# EAGLE design LB_BIT_i35_delay-v03(5_5) (EAGLE 6.6.0)
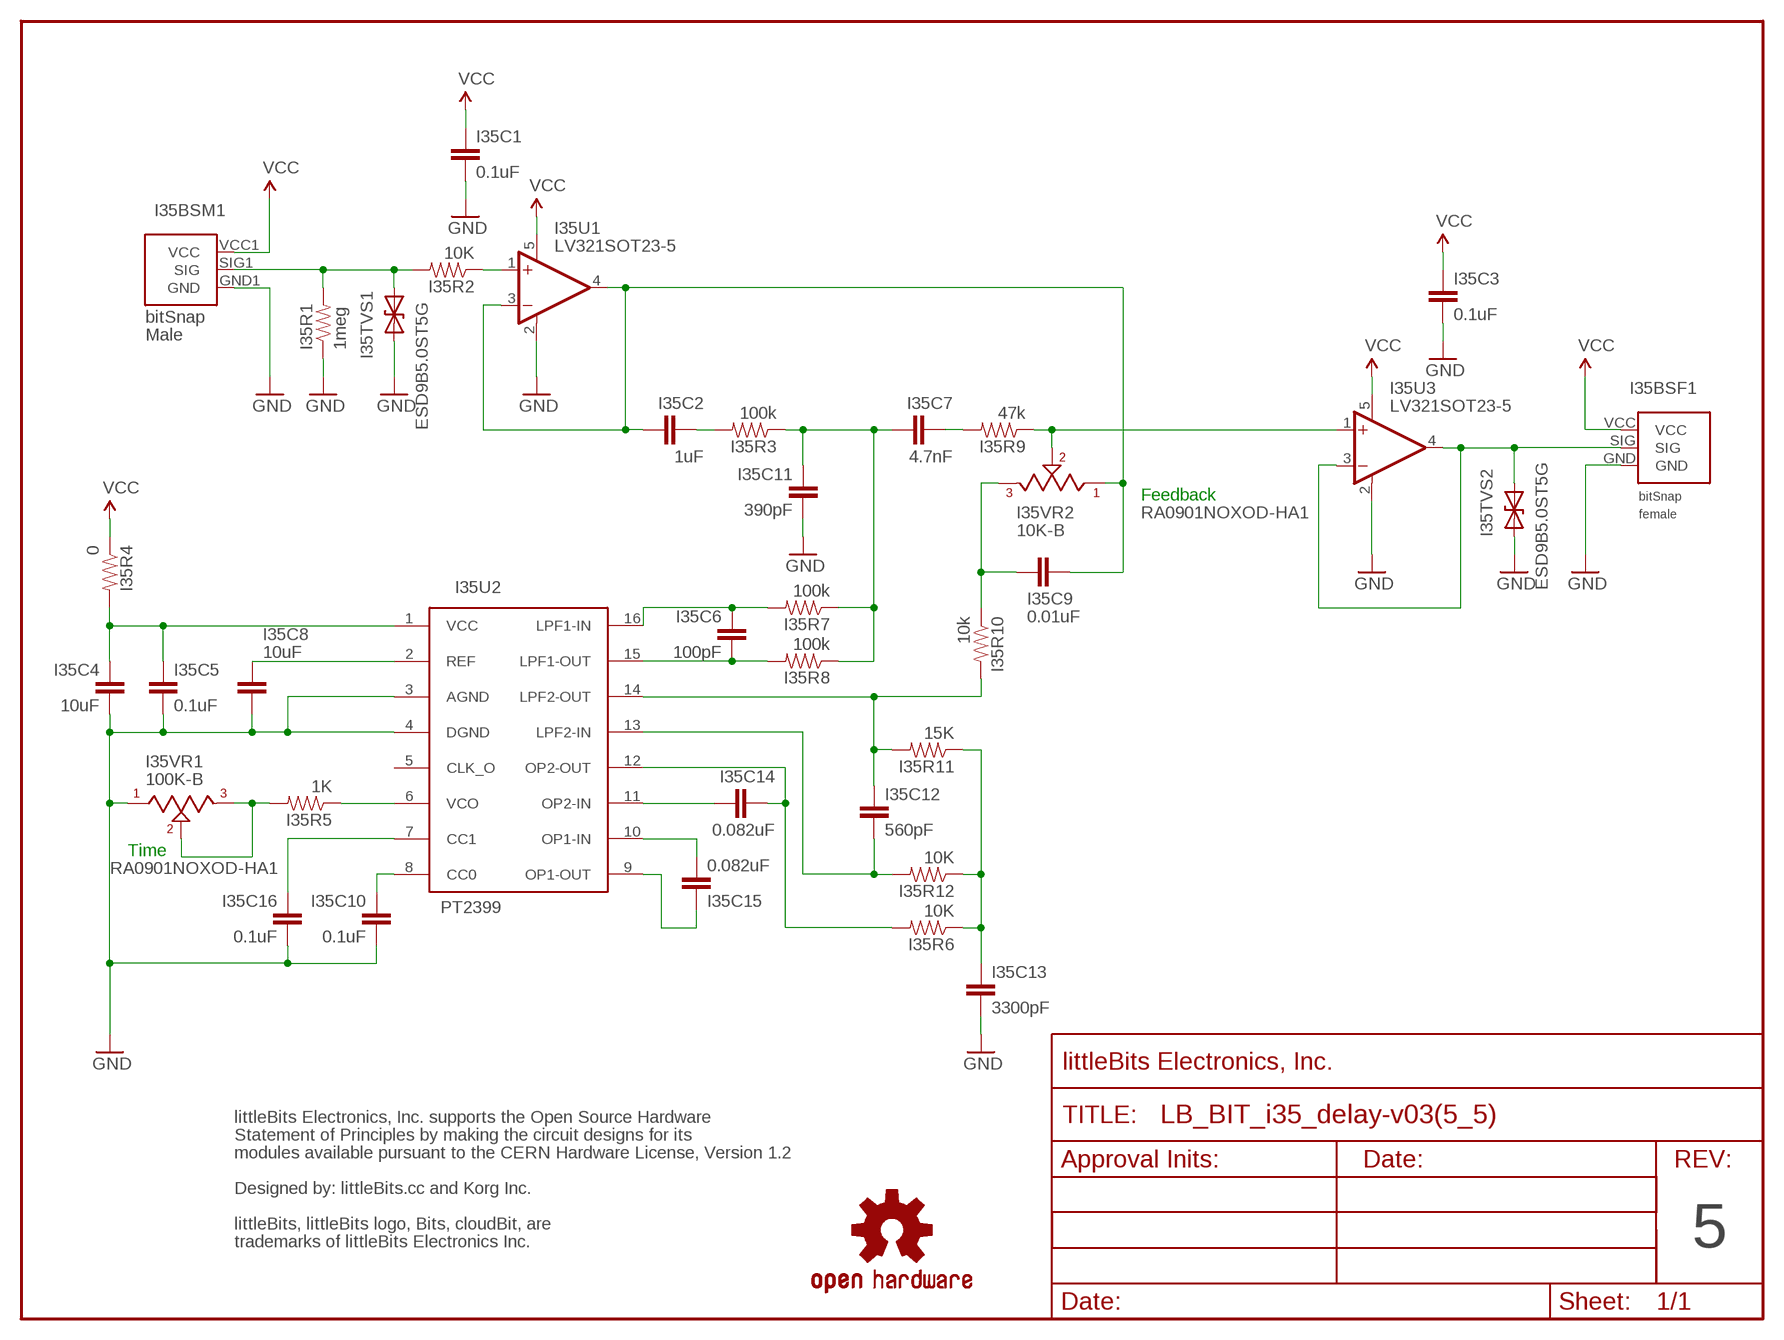
[diagram p0: schematic, sheet 1]

## Parts
I35BSF1  BITSNAP_V03_FEMALE  [BITSNAP_V03_FEMALE]
I35BSM1  BITSNAP_V03_MALE  [BITSNAP_V03_MALE]
I35C1  0.1uF  CAPCAP-0603  [CAP-0603]
I35C2  1uF  CAPCAP-0603  [CAP-0603]
I35C3  0.1uF  CAPCAP-0603  [CAP-0603]
I35C4  10uF  CAPCAP-0603  [CAP-0603]
I35C5  0.1uF  CAPCAP-0603  [CAP-0603]
I35C6  100pF  CAPCAP-0603  [CAP-0603]
I35C7  4.7nF  CAPCAP-0603  [CAP-0603]
I35C8  10uF  CAPCAP-0603  [CAP-0603]
I35C9  0.01uF  CAPCAP-0603  [CAP-0603]
I35C10  0.1uF  CAPCAP-0603  [CAP-0603]
I35C11  390pF  CAPCAP-0603  [CAP-0603]
I35C12  560pF  CAPCAP-0603  [CAP-0603]
I35C13  3300pF  CAPCAP-0603  [CAP-0603]
I35C14  0.082uF  CAPCAP-0603  [CAP-0603]
I35C15  0.082uF  CAPCAP-0603  [CAP-0603]
I35C16  0.1uF  CAPCAP-0603  [CAP-0603]
I35R1  1meg  RESISTOR0603  [RES-0603]
I35R2  10K  RESISTOR0603  [RES-0603]
I35R3  100k  RESISTOR0603  [RES-0603]
I35R4  0  RESISTOR0603  [RES-0603]
I35R5  1K  RESISTOR0603  [RES-0603]
I35R6  10K  RESISTOR0603  [RES-0603]
I35R7  100k  RESISTOR0603  [RES-0603]
I35R8  100k  RESISTOR0603  [RES-0603]
I35R9  47k  RESISTOR0603  [RES-0603]
I35R10  10k  RESISTOR0603  [RES-0603]
I35R11  15K  RESISTOR0603  [RES-0603]
I35R12  10K  RESISTOR0603  [RES-0603]
I35TVS1  ESD9B5.0ST5G  DIODE-TVSSOD-923  [SOD-923]
I35TVS2  ESD9B5.0ST5G  DIODE-TVSSOD-923  [SOD-923]
I35U1  LV321SOT23-5  [SOT23-5]
I35U2  PT2399  [SO16]
I35U3  LV321SOT23-5  [SOT23-5]
I35VR1  100K-B  ALPS_POTTH  [ALPS_POT]
I35VR2  10K-B  ALPS_POTTH  [ALPS_POT]
U$1  FRAME-LETTER-OHWOHW  [FABDWG01-OHW]
U$2  OSHWCREDIT-KORG  [OSHWCREDIT-KORG]
U$3  OSHW-LOGOL  [OSHW-LOGO-L]

## Nets
GND: I35BSF1.GND I35BSM1.GND1(GND) I35C1.2 I35C3.2 I35C4.2 I35C5.2 I35C8.2 I35C10.2 I35C11.2 I35C13.2 I35C16.2 I35R1.1 I35TVS1.1(A) I35TVS2.1(A) I35U1.2(V-) I35U2.3(AGND) I35U2.4(DGND) I35U3.2(V-) I35VR1.1
N$1: I35C2.2 I35R3.2
N$4: I35R2.1 I35U1.1(+IN)
N$6: I35C7.1 I35C11.1 I35R3.1 I35R7.1 I35R8.1
N$10: I35C6.2 I35R8.2 I35U2.15(LPF1-OUT)
N$11: I35C6.1 I35R7.2 I35U2.16(LPF1-IN)
N$13: I35R9.1 I35U3.1(+IN) I35VR2.2
N$14: I35C7.2 I35R9.2
N$15: I35C9.1 I35R10.1 I35VR2.3
N$16: I35C2.1 I35C9.2 I35U1.3(-IN) I35U1.4(OUT) I35VR2.1
N$17: I35C12.1 I35R10.2 I35R11.2 I35U2.14(LPF2-OUT)
N$18: I35C12.2 I35R12.2 I35U2.13(LPF2-IN)
N$19: I35C13.1 I35R6.1 I35R11.1 I35R12.1
N$20: I35C14.2 I35R6.2 I35U2.12(OP2-OUT)
N$21: I35C14.1 I35U2.11(OP2-IN)
N$22: I35C15.2 I35U2.10(OP1-IN)
N$24: I35C15.1 I35U2.9(OP1-OUT)
N$25: I35C10.1 I35U2.8(CC0)
N$26: I35C16.1 I35U2.7(CC1)
N$28: I35R5.2 I35VR1.2 I35VR1.3
N$29: I35R5.1 I35U2.6(VCO)
N$31: I35C8.1 I35U2.2(REF)
N$32: I35C4.1 I35C5.1 I35R4.2 I35U2.1(VCC)
SIG_IN: I35BSM1.SIG1(SIG) I35R1.2 I35R2.2 I35TVS1.2(C)
SIG_OUT: I35BSF1.SIG I35TVS2.2(C) I35U3.3(-IN) I35U3.4(OUT)
VCC: I35BSF1.VCC I35BSM1.VCC1(VCC) I35C1.1 I35C3.1 I35R4.1 I35U1.5(V+) I35U3.5(V+)
Unconnected: I35U2.5(CLK_O)

## Notes on the sheet
- Feedback
- RA0901NOXOD-HA1
- Time
- RA0901NOXOD-HA1
- 5

## Library data of the parts
I35BSF1 = bitSnap:BITSNAP_V03_FEMALE
I35BSM1 = bitSnap:BITSNAP_V03_MALE
I35C1-I35C16 = LITTLEBITS:CAP
I35R1-I35R12 = LITTLEBITS:RESISTOR
I35TVS1 I35TVS2 = LITTLEBITS:DIODE-TVS: Bidirectional Transient Voltage Suppression Diode: Device conducts in avalanche mode after reaching a part dependent voltage threshold. Used for limiting voltage spikes on ESD sensitive inputs and outputs.; IEC_ESD_PROT0: +/-18kV; LB_PN: ?; MPN: ESD9B5.0ST5G; V_CLAMP: ?; V_OPERATION: 5V
I35U1 I35U3 = LITTLEBITS:LV321
I35U2 = LITTLEBITS:PT2399
I35VR1 I35VR2 = LITTLEBITS:ALPS_POT
U$1 = LITTLEBITS:FRAME-LETTER-OHW
U$2 = LITTLEBITS:OSHWCREDIT-KORG
U$3 = LITTLEBITS:OSHW-LOGO: Open Source Hardware Logo This logo indicates the piece of hardware it is found on incorporates a OSHW license and/or adheres to the definition of open source hardware found here: http://freedomdefined.org/OSHW

## Board
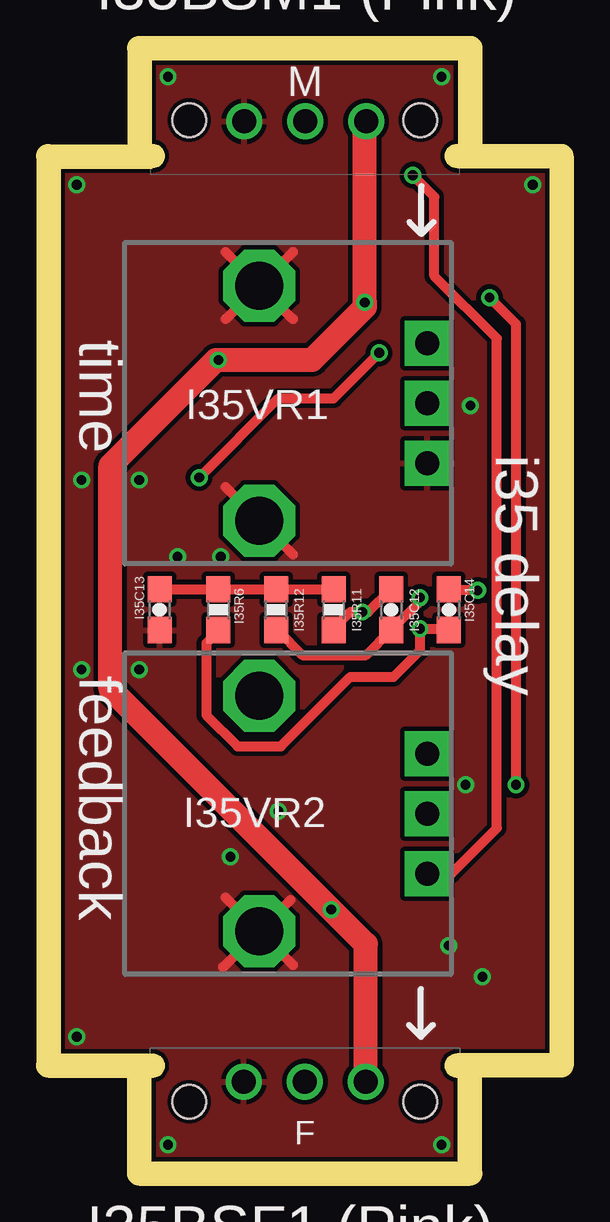
[diagram p1: board, top side]
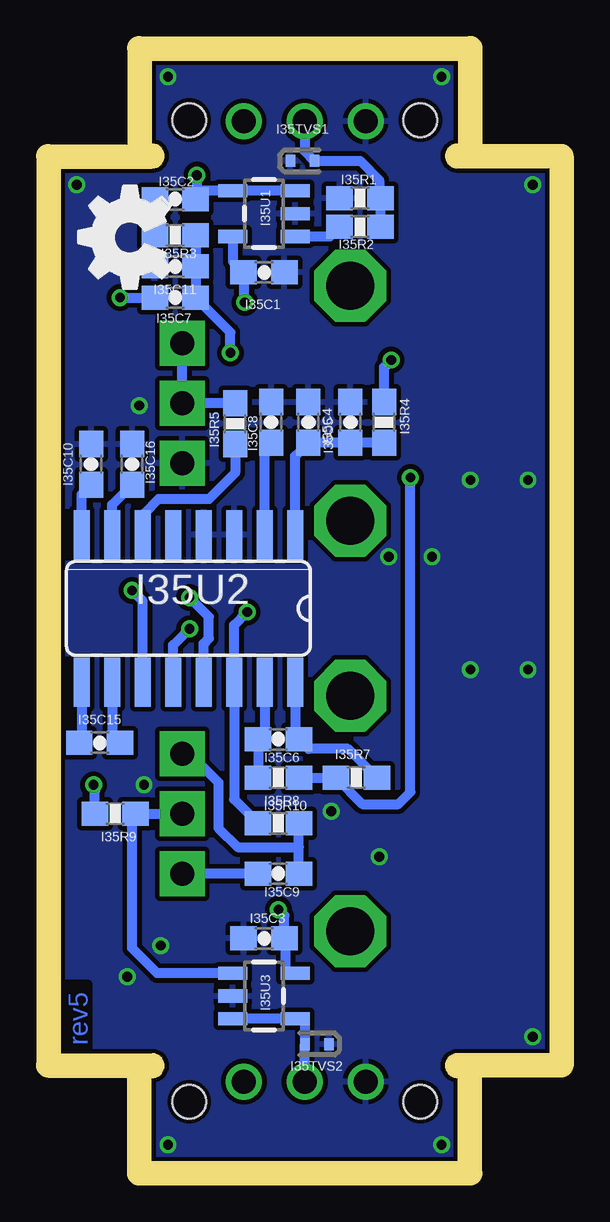
[diagram p2: board, bottom side, seen from below]

Size 20.4 x 45.9 mm. Coordinates in mm from the lower left corner, seen from the top.
Outline: 0,41.4 0,4.5
Outline: 20.4,41.4 20.4,4.5
Copper layers (1*16): Top 0.035mm / dielectric 1.5mm / Bottom 0.035mm
Design rules "littleBitsDRC": minimum track width 0.2mm, minimum drill 0.4mm, track to track 0.2mm, track to pad 0.2mm, pad to pad 0.2mm, via to via 0.2mm, smd to smd 0mil, copper to edge 0.2mm, drill to drill 0.2mm, minimum pad ring 0.2mm, minimum via ring 0.15mm, stop-mask expansion 0.1mm, vias tented up to drill 0mil, thermal gap 0.2mm
Milling: 4 lines

### Footprints (pad centres in the part's own frame; a part is rotated, then mirrored left to right if it is on the bottom)
BITSNAP_V03_FEMALE = drill 1: GND 3.91,3.33; SIG 6.45,3.33; VCC 8.99,3.33 | hole 1.4: 1.63,2.5; 11.27,2.5
BITSNAP_V03_MALE = drill 1: GND1 8.98,2.56; SIG1 6.44,2.56; VCC1 3.9,2.56 | hole 1.4: 11.27,2.5; 1.63,2.5
CAP-0603 = smd 1.1 x 1: 1 -0.85,0; 2 0.85,0
RES-0603 = smd 1.1 x 1: 1 -0.85,0; 2 0.85,0
SOD-923 = smd 0.4 x 0.5: 1 -0.5,0; 2 0.5,0
SOT23-5 = smd 0.55 x 1.2: 1 -0.95,-1.3; 2 0,-1.3; 3 0.95,-1.3; 4 0.95,1.3; 5 -0.95,1.3
SO16 = smd 0.66 x 2.032: 1 -4.445,-3.073; 2 -3.175,-3.073; 3 -1.905,-3.073; 4 -0.635,-3.073; 5 0.635,-3.073; 6 1.905,-3.073; 7 3.175,-3.073; 8 4.445,-3.073; 9 4.445,3.073; 10 3.175,3.073; 11 1.905,3.073; 12 0.635,3.073; 13 -0.635,3.073; 14 -1.905,3.073; 15 -3.175,3.073; 16 -4.445,3.073
ALPS_POT = drill 1 pad 1.88 square: 1 7,-2.5; 2 7,0; 3 7,2.5 | drill 2 octagon: LUG1 0,-4.9; LUG2 0,4.9

### Placement (x,y rotation side)
E$1  [FABDWG01-OHW]  61.55,1.6 0 top  (outside the outline)
E$2  [OSHWCREDIT-KORG]  -14.95,-69.8 0 top  (outside the outline)
I35BSF1  3.75,0 0 top
I35BSM1  16.65,45.9 180 top
I35C1  11.9,37.05 0 bottom
I35C2  15.6,40.1 180 bottom
I35C3  11.9,9.3 180 bottom
I35C4  8.3,30.8 90 bottom
I35C5  10.05,30.8 90 bottom
I35C6  11.3,17.6 180 bottom
I35C7  15.6,36 180 bottom
I35C8  11.6,30.8 90 bottom
I35C9  11.3,12 180 bottom
I35C10  19.1,29.05 90 bottom
I35C11  15.6,37.3 180 bottom
I35C12  13.8,23 270 top
I35C13  4.15,23 270 top
I35C14  16.2,23 270 top
I35C15  18.75,17.45 0 bottom
I35C16  17.4,29.05 90 bottom
I35R1  7.9,40.15 0 bottom
I35R2  7.9,38.95 0 bottom
I35R3  15.6,38.6 180 bottom
I35R4  6.9,30.8 270 bottom
I35R5  13.1,30.75 90 bottom
I35R6  6.6,23 270 top
I35R7  8.05,16 0 bottom
I35R8  11.3,16 180 bottom
I35R9  18.1,14.5 180 bottom
I35R10  11.3,14.1 180 bottom
I35R11  11.4,23 270 top
I35R12  9,23 270 top
I35TVS1  10.3,41.7 0 bottom
I35TVS2  9.7,4.9 180 bottom
I35U1  11.9,39.5 90 bottom
I35U2  15.05,23.05 180 bottom
I35U3  11.9,6.9 270 bottom
I35VR1  8.3,31.6 0 top
I35VR2  8.3,14.5 0 top
U$3  29.65,-67.2 0 top  (outside the outline)
U$8  [OSHW_FILLX150_NOTEXT]  15.81,35.56 0 top

### Tracks (layer width: path | path; a pad name or v marks a point on that pad's centre or on a via)
GND  (via drill 0.41)
  Top 0.406: 6.9,37.9 9.7,35.1 | 6.9,35.1 9.7,37.9 | 6.9,28.1 9.7,25.3 | 6.9,11 9.7,8.2 | 6.8,8.1 9.6,10.9
  other vias: 4.5,0.7 15.9,0.7 4.5,45.2 15.9,45.2 19.7,40.7 0.7,40.7 0.7,5.2 9.1,14.6 7.1,12.7 3.3,20.5 0.9,20.5 3.3,28.4 0.9,28.4 17.1,31.5 16.9,15.7 4.9,25.2 6.7,25.2 16.2,9 17.6,7.7
  pour Top: 0,0 20.4,0 20.4,45.9 0,45.9
  pour Bottom: 0,0 20.4,0 20.4,45.9 0,45.9
N$1
  Bottom 0.406: I35C2.2 I35R3.2
N$4
  Bottom 0.406: I35U1.1 9.15,38.55 I35R2.1
N$6  (via drill 0.41)
  Top 0.406: v5.8,28.5 9.1,31.8 11.4,31.8 v13.3,33.7
  Bottom 0.406: I35R3.1 I35C11.1 I35C7.1 13.3,34.55 v13.3,33.7 | I35R8.1 I35R7.1 7.8,14.9 6.3,14.9 5.8,15.4 v5.8,28.5
N$10
  Bottom 0.406: I35U2.15 11.88,17.88 I35C6.2 I35R8.2
N$11
  Bottom 0.406: I35R7.2 8.4,17.2 10.05,17.2 I35C6.1 10.6,17.76 I35U2.16
N$13
  Bottom 0.406: I35VR2.2 I35R9.1 17.4,14.45 17.4,8.9 16.35,7.85 I35U3.1
N$14  (via drill 0.41)
  Top 0.406: v19,15.7 19,34.9 v17.9,36
  Bottom 0.406: I35R9.2 18.95,15.45 v19,15.7 | v17.9,36 I35C7.2
N$15
  Bottom 0.406: I35C9.1 10.45,13.1 | 10.45,13.1 I35R10.1 | I35VR2.3 15,17 13.8,15.8 13.8,13.9 13,13.1 10.45,13.1
N$16  (via drill 0.41)
  Top 0.406: I35VR2.1 16.3,12 18.2,13.9 18.2,34.3 15.6,36.9 15.6,40.2 v14.7,41.1
  Bottom 0.406: I35C9.2 I35VR2.1 | I35U1.3 I35U1.4 14.7,40.45 | v14.7,41.1 14.7,40.45 | 14.7,40.45 I35C2.1
N$17  (via drill 0.41)
  Top 0.406: I35C12.1 12.85,22.9 v12.6,22.9 12.1,22.9 11.4,22.2 I35R11.2
  Bottom 0.406: v12.6,22.9 13.14,22.36 I35U2.14 13.14,15.09 I35R10.2
N$18  (via drill 0.41)
  Top 0.406: I35R12.2 9.05,22.15 10.1,21.1 12.75,21.1 I35C12.2 15,23.35 v15,23.5
  Bottom 0.406: I35U2.13 14.41,21.59 14.2,21.8 14.2,22.7 v15,23.5
N$19
  Top 0.406: I35C13.1 I35R6.1 I35R12.1 I35R11.1
N$20  (via drill 0.41)
  Top 0.406: I35C14.2 16.15,22.2 v15,22.2 15,21.3 13.9,20.2 12.1,20.2 9.2,17.3 7.4,17.3 6.1,18.6 6.1,21.6 6.6,22.1 I35R6.2
  Bottom 0.406: I35U2.12 15.68,21.52 v15,22.2
N$21  (via drill 0.41)
  Top 0.406: v17.4,23.8 16.25,23.8 I35C14.1
  Bottom 0.406: I35U2.11 16.95,23.36 v17.4,23.8
N$22
  Bottom 0.406: I35U2.10 18.22,17.78 I35C15.2
N$24
  Bottom 0.406: I35U2.9 19.49,17.55 I35C15.1
N$25
  Bottom 0.406: I35U2.8 19.49,27.8 I35C10.1
N$26
  Bottom 0.406: I35U2.7 18.22,27.38 I35C16.1
N$28
  Bottom 0.406: I35R5.2 I35VR1.2 I35VR1.3
N$29
  Bottom 0.406: I35R5.1 13.1,28.7 14.2,27.6 16.3,27.6 16.9,27 16.9,26.18 I35U2.6
N$31
  Bottom 0.406: I35U2.2 11.88,29.68 I35C8.1
N$32
  Bottom 0.406: I35R4.2 I35C4.1 I35C5.1 10.6,29.4 I35U2.1
SIG_IN
  Bottom 0.406: I35BSM1.SIG1 10.21,42.11 I35TVS1.2 7.9,41.7 7.1,40.9 7.1,40.2 I35R1.2 I35R2.2
SIG_OUT
  Bottom 0.406: I35BSF1.SIG I35TVS2.2 10.2,5.95 I35U3.4 I35U3.3
VCC  (via drill 0.41)
  Top 1: I35BSF1.VCC 12.74,9.06 v11.3,10.5 2.1,19.7 2.1,29 6.5,33.4 v6.6,33.4 10.5,33.4 12.7,35.6 v12.7,35.8 12.7,43.29 I35BSM1.VCC1
  Bottom 0.406: v12.7,35.8 12.75,35.85 I35C1.1 13.2,37.5 I35U1.5 | I35R4.1 6.9,33.1 v6.6,33.4 | v11.3,10.5 11.05,10.25 I35C3.1 11,9.15 11,8 10.85,7.85 I35U3.5

### Text on the board
Bottom: rev5
tPlace: time | i35 delay | feedback
tNames: I35BSM1 (Pink) | I35BSF1 (Pink)
Reference: XLARGE
dxf: 5 | Audio Delay Bit